# Altium project ArakDisCharger.PrjPcb (part 2 of 2)

## Sheet Arak-AnalogueFrontend.SchDoc
size 431 x 279 mm; Date: Not shown in title block; ApprovedBy: Not shown in title block; CheckedBy: Not shown in title block; Author: Not shown in title block; CompanyName: Not shown in title block; Engineer: Not shown in title block; Organization: Not shown in title block; Address1: Not shown in title block; Address2: Not shown in title block; Address3: Not shown in title block; Address4: Not shown in title block; DocumentNumber: 6; Revision: Use project parameter SCH_Rev; SheetNumber: 6; SheetTotal: 11; PageSetup: Record=PageOptions|CenterHorizontal=True|CenterVertical=True|PrintScale=1.00|XCorrection=1.00|YCorrection=1.00|PrintKind=0|BorderSize=5000000|LeftOffset=0|BottomOffset=0|Orientation=2|PaperLength=1000|PaperWidth=1000|Scale=100|PaperSource=15|PrintQuality=600|MediaType=1|DitherType=10|PaperKind=Letter|PrintScaleMode=1; CurrentTime: Not shown in title block; CurrentDate: Not shown in title block; Time: Not shown in title block; DocumentFullPathAndName: Not shown in title block; DocumentName: Not shown in title block; ModifiedDate: Not shown in title block; ImagePath: Not shown in title block
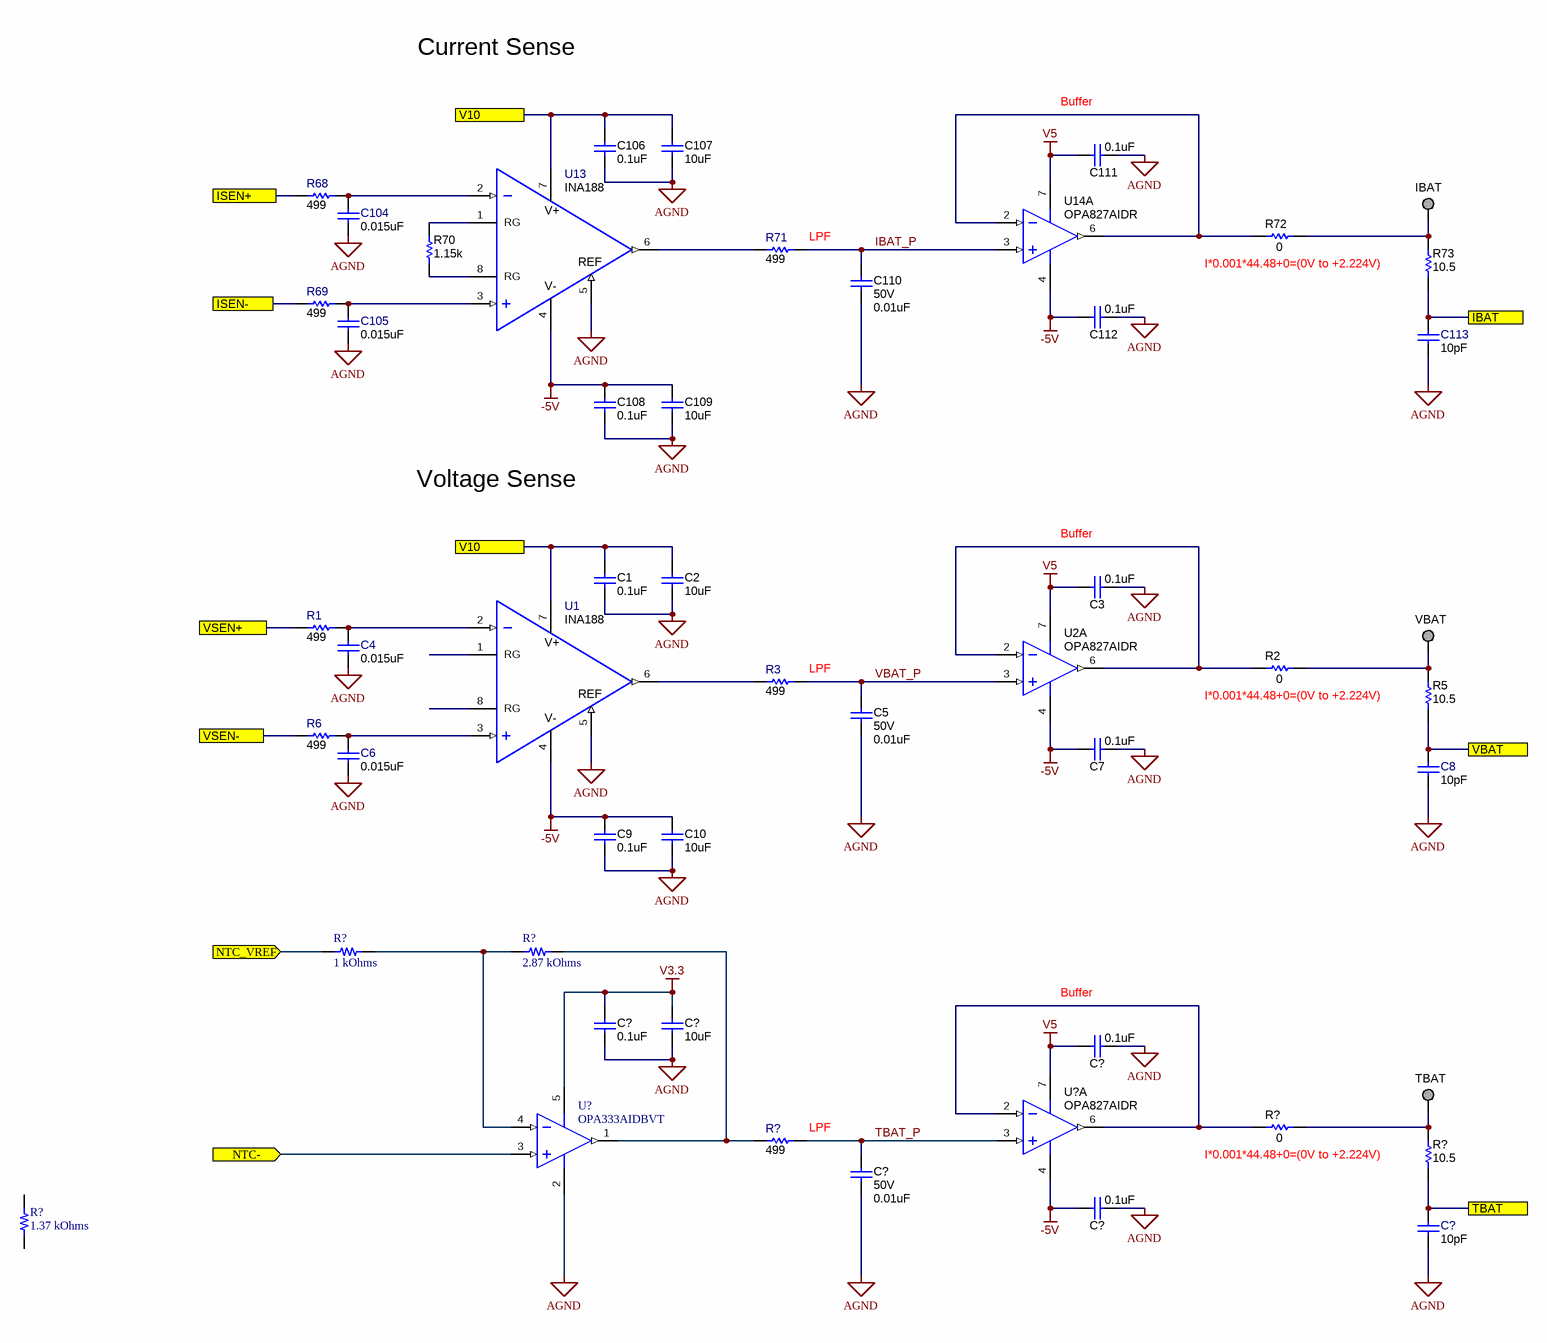
[diagram p1: Arak-AnalogueFrontend.SchDoc]

### Parts
(Parts that share a designator on the sheet are numbered #1, #2 ... from top to bottom, then left to right.)
C1  ValueDisplayed: 0.1uF  [0603]  (hidden comment: Capacitor)
C2  ValueDisplayed: 10uF  [0805_HV]  (hidden comment: Capacitor)
C3  ValueDisplayed: 0.1uF  [0603]  (hidden comment: Capacitor)
C4  ValueDisplayed: 0.015uF  [0603]  (hidden comment: Capacitor)
C5  VDC_V: 50V  ValueDisplayed: 0.01uF  [0603]  (hidden comment: GCM188R71H103KA37D)
C6  ValueDisplayed: 0.015uF  [0603]  (hidden comment: Capacitor)
C7  ValueDisplayed: 0.1uF  [0603]  (hidden comment: Capacitor)
C8  ValueDisplayed: 10pF  [0603]  (hidden comment: Capacitor)
C9  ValueDisplayed: 0.1uF  [0603]  (hidden comment: Capacitor)
C10  ValueDisplayed: 10uF  [0805_HV]  (hidden comment: Capacitor)
C104  ValueDisplayed: 0.015uF  [0603]  (hidden comment: Capacitor)
C105  ValueDisplayed: 0.015uF  [0603]  (hidden comment: Capacitor)
C106  ValueDisplayed: 0.1uF  [0603]  (hidden comment: Capacitor)
C107  ValueDisplayed: 10uF  [0805_HV]  (hidden comment: Capacitor)
C108  ValueDisplayed: 0.1uF  [0603]  (hidden comment: Capacitor)
C109  ValueDisplayed: 10uF  [0805_HV]  (hidden comment: Capacitor)
C110  VDC_V: 50V  ValueDisplayed: 0.01uF  [0603]  (hidden comment: GCM188R71H103KA37D)
C111  ValueDisplayed: 0.1uF  [0603]  (hidden comment: Capacitor)
C112  ValueDisplayed: 0.1uF  [0603]  (hidden comment: Capacitor)
C113  ValueDisplayed: 10pF  [0603]  (hidden comment: Capacitor)
C?#1  ValueDisplayed: 0.1uF  [0603]  (hidden comment: Capacitor)
C?#2  ValueDisplayed: 10uF  [0805_HV]  (hidden comment: Capacitor)
C?#3  ValueDisplayed: 0.1uF  [0603]  (hidden comment: Capacitor)
C?#4  VDC_V: 50V  ValueDisplayed: 0.01uF  [0603]  (hidden comment: GCM188R71H103KA37D)
C?#5  ValueDisplayed: 0.1uF  [0603]  (hidden comment: Capacitor)
C?#6  ValueDisplayed: 10pF  [0603]  (hidden comment: Capacitor)
IBAT  Pogo Pad  [PogoPad]  (value not drawn)  (no BOM)
R1  ValueDisplayed: 499  [0603]  (hidden comment: Resistor)
R2  ValueDisplayed: 0  [0603]  (hidden comment: Resistor)
R3  ValueDisplayed: 499  [0603]  (hidden comment: Resistor)
R5  ValueDisplayed: 10.5  [0603]  (hidden comment: RC0603FR-0710R5L)
R6  ValueDisplayed: 499  [0603]  (hidden comment: Resistor)
R68  ValueDisplayed: 499  [0603]  (hidden comment: Resistor)
R69  ValueDisplayed: 499  [0603]  (hidden comment: Resistor)
R70  1.15k  [0603]
R71  ValueDisplayed: 499  [0603]  (hidden comment: Resistor)
R72  ValueDisplayed: 0  [0603]  (hidden comment: Resistor)
R73  ValueDisplayed: 10.5  [0603]  (hidden comment: RC0603FR-0710R5L)
R?#1  1 kOhms  [RES 0603_1608]
R?#2  2.87 kOhms  [RES 0603_1608]
R?#3  ValueDisplayed: 0  [0603]  (hidden comment: Resistor)
R?#4  ValueDisplayed: 499  [0603]  (hidden comment: Resistor)
R?#5  ValueDisplayed: 10.5  [0603]  (hidden comment: RC0603FR-0710R5L)
R?#6  1.37 kOhms  [RES 0603_1608]
TBAT  Pogo Pad  [PogoPad]  (value not drawn)  (no BOM)
U1  INA188  [D0008A_N]
U2  OPA827AIDR  [D0008A_L]  (part A of 2)
U13  INA188  [D0008A_N]
U14  OPA827AIDR  [D0008A_L]  (part A of 2)
U?#1  OPA827AIDR  [D0008A_L]  (part A of 2)
U?#2  OPA333AIDBVT  [DBV0005A_M]
VBAT  Pogo Pad  [PogoPad]  (value not drawn)  (no BOM)

### Ports
IBAT, ISEN+, ISEN-, NTC- (in), NTC_VREF (in), TBAT, V10, VBAT, VSEN+, VSEN-

### Nets
-5V: C7.1 C9.1 C10.1 C108.1 C109.1 C112.1 C?#5.1 U1.4(V-) U2.4(V-) U13.4(V-) U14.4(V-) U?#1.4(V-)
AGND: C1.2 C2.2 C3.2 C4.2 C5.2 C6.2 C7.2 C8.1 C9.2 C10.2 C104.2 C105.2 C106.2 C107.2 C108.2 C109.2 C110.2 C111.2 C112.2 C113.1 C?#1.2 C?#2.2 C?#3.2 C?#4.2 C?#5.2 C?#6.1 U1.5(REF) U13.5(REF) U?#2.2(V-)
V3.3: C?#1.1 C?#2.1 U?#2.5(V+)
V5: C3.1 C111.1 C?#3.1 U2.7(V+) U14.7(V+) U?#1.7(V+)
IBAT_P: C110.1 R71.1 U14.3(IN+)
TBAT_P: C?#4.1 R?#4.1 U?#1.3(IN+)
VBAT_P: C5.1 R3.1 U2.3(IN+)
NetC1_1: C1.1 C2.1 C106.1 C107.1 U1.7(V+) U13.7(V+) ; port V10
NetC4_1: C4.1 R1.1 U1.2(IN-)
NetC6_1: C6.1 R6.1 U1.3(IN+)
NetC8_2: C8.2 R5.1 ; port VBAT
NetC104_1: C104.1 R68.1 U13.2(IN-)
NetC105_1: C105.1 R69.1 U13.3(IN+)
NetC113_2: C113.2 R73.1 ; port IBAT
NetC?#6_2: C?#6.2 R?#5.1 ; port TBAT
NetIBAT_1: IBAT.1 R72.2 R73.2
NetR1_2: R1.2 ; port VSEN+
NetR2_1: R2.1 U2.2(IN-) U2.6(OUT)
NetR2_2: R2.2 R5.2 VBAT.1
NetR3_2: R3.2 U1.6(OUT)
NetR6_2: R6.2 ; port VSEN-
NetR68_2: R68.2 ; port ISEN+
NetR69_2: R69.2 ; port ISEN-
NetR70_1: R70.1 U13.8(RG)
NetR70_2: R70.2 U13.1(RG)
NetR71_2: R71.2 U13.6(OUT)
NetR72_1: R72.1 U14.2(IN-) U14.6(OUT)
NetR?#1_1: R?#1.1 ; port NTC_VREF
NetR?#1_2: R?#1.2 R?#2.1 U?#2.4(IN-)
NetR?#2_2: R?#2.2 R?#4.2 U?#2.1(OUT)
NetR?#3_1: R?#3.1 U?#1.2(IN-) U?#1.6(OUT)
NetR?#3_2: R?#3.2 R?#5.2 TBAT.1
NetU?#2_3: U?#2.3(IN+) ; port NTC-

Not connected (* = marked no-connect by the designer): R?#6 1 2; U1 1(RG) 8(RG)

### Notes on the sheet
- Current Sense
- (near C111) Buffer
- (near R71) LPF
- (near R72) I*0.001*44.48+0=(0V to +2.224V)
- Voltage Sense
- (near C3) Buffer
- (near R3) LPF
- (near R2) I*0.001*44.48+0=(0V to +2.224V)
- (near C?#3) Buffer
- (near R?#4) LPF
- (near R?#3) I*0.001*44.48+0=(0V to +2.224V)
- Drawn By:
- SVN Rev:
- Number:
- TID #:
- Orderable:
- Rev:
- Sheet Title:
- File:
- Project Title:
- Designed for:
- Assembly Variant:
- Mod. Date:
- Sheet:
- Size:
- of
- B
- http://www.ti.com
- Texas Instruments and/or its licensors do not warrant the accuracy or completeness of this specification or any information contained therein. Texas Instruments and/or its licensors do not warrant that this design will meet the specifications, will be suitable for your application or fit for any particular purpose, or will operate in an implementation. Texas Instruments and/or its licensors do not warrant that the design is production worthy. You should completely validate and test your design implementation to confirm the system functionality for your application.
- Engineer:
- Contact:
- © Texas Instruments

### Library data of the parts
C1 C3 C7 C9 C106 C108 C111 C112 C?#1 C?#3 C?#5 = CMP-0006752-5: CAP, CERM, 0.1 uF, 25 V, +/- 5%, X7R, 0603; PartNumber: 06033C104JAT2A; Manufacturer: AVX; Polarized: N; Value: 0.1uF; U/M: EA; Cap_F: 100nF; ESR_ohm: 0.05; Value1: 0.05 ohm; VDC_V: 25V; TaMin_C: -55°C; TaMax_C: 125°C; AEC Category: Q200; SizeArea_mm2: 1.28; SizeAreaWB_mm2: 4.68; SizeX_mm: 1.6; SizeY_mm: 0.8; SizeZ_mm: 1; CompType: Capacitor; PackageReference: 0603; RoHS: Y; Tolerance_%: 5%; Value2: 25V; MountType: SMT; Technology: Ceramic; TempCo: X7R; Cap_Case: 0603; Published: 2008-06-19; Publisher: Texas Instruments; LatestRevisionDate: 2017-03-09; ComponentLink1Description: Datasheet link; ComponentLink1URL: http://datasheets.avx.com/X7RDielectric.pdf; Supplier 1: Digi-Key; Supplier Part Number 1: 478-3713-1-ND; Supplier 2: Mouser; Supplier Part Number 2: 581-06033C104JAT2A; Supplier 3: Farnell; Supplier Part Number 3: 1740614; AEC Qualified: N; AEC Grade: N/A
C2 C10 C107 C109 C?#2 = CMP-0008315-2: CAP, CERM, 10 uF, 10 V, +/- 10%, X7R, 0805; PartNumber: GRM21BR71A106KE51L; Manufacturer: MuRata; Polarized: N; Value: 10uF; U/M: EA; Cap_F: 10µF; ESR_ohm: 3m; Value1: 0.003 ohm; VDC_V: 10V; TaMin_C: -55°C; TaMax_C: 125°C; Cap_Case: 0805; AEC Category: Q200; SizeArea_mm2: 2.5; SizeAreaWB_mm2: 6.75; SizeX_mm: 2; SizeY_mm: 1.25; SizeZ_mm: 1.45; CompType: Capacitor; PackageReference: 0805; RoHS: Y; Tolerance_%: 10%; Value2: 10V; MountType: SMT; Technology: Ceramic; TempCo: X7R; Published: 2008-06-19; Publisher: Texas Instruments; LatestRevisionDate: 2017-03-09; ComponentLink1Description: Datasheet link; ComponentLink1URL: http://search.murata.co.jp/Ceramy/PnsearchViewAction.do?HnOFG=ON&HnNFG=ON&SEL_CNT=50&sLang=en&sKey=GRM21BR71A106KE51L&x=9&y=9&search=startwith; Supplier 1: Digi-Key; Supplier Part Number 1: 490-3905-1-ND; Supplier 2: Mouser; Supplier Part Number 2: 81-GRM21BR71A106KE51; Supplier 3: Farnell; Supplier Part Number 3: 1828828; AEC Qualified: ?
C4 C6 C104 C105 = CMP-0007383-5: CAP, CERM, 0.015 uF, 16 V, +/- 10%, X7R, 0603; PartNumber: GRM188R71C153KA01D; Manufacturer: MuRata; Polarized: N; U/M: EA; Cap_F: 15nF; Value1: Unknown; VDC_V: 16V; TaMin_C: -55°C; TaMax_C: 125°C; SizeArea_mm2: 1.28; SizeAreaWB_mm2: 4.68; SizeX_mm: 1.6; SizeY_mm: 0.8; SizeZ_mm: 1; AEC Category: Q200; CompType: Capacitor; Value: 0.015uF; PackageReference: 0603; RoHS: Y; Tolerance_%: 10%; Value2: 16V; MountType: SMT; Technology: Ceramic; TempCo: X7R; Cap_Case: 0603; Published: 2008-06-19; Publisher: Texas Instruments; LatestRevisionDate: 2017-03-09; ComponentLink1Description: Datasheet link; ComponentLink1URL: http://search.murata.co.jp/Ceramy/PnsearchViewAction.do?HnOFG=ON&HnNFG=ON&SEL_CNT=50&sLang=en&sKey=GRM188R71C153KA01D&x=9&y=9&search=startwith; Supplier 1: Mouser; Supplier Part Number 1: 81-GRM188R71C153KA; AEC Qualified: ?
C5 C110 C?#4 = CMP-0007143-4: CAP, CERM, 0.01 uF, 50 V, +/- 10%, X7R, AEC-Q200 Grade 1, 0603; Manufacturer: MuRata; TaMin_C: -55°C; Polarized: N; SizeAreaWB_mm2: 4.68; Value1: Unknown; U/M: EA; Value: 0.01uF; TaMax_C: 125°C; SizeZ_mm: 1; SizeX_mm: 1.6; SizeY_mm: 0.8; SizeArea_mm2: 1.28; CompType: Capacitor; AEC Qualified: Y; Cap_F: 10nF; AEC Category: Q200; Supplier Part Number 2: 45Y5166; Publisher: Texas Instruments; Supplier 2: Newark; Supplier Part Number 3: 81-GCM188R71H103KA7D; TempCo: X7R; Supplier 3: Mouser; Published: 2008-06-19; RoHS: Y; MountType: SMT; Supplier 1: Digi-Key; PackageReference: 0603; Tolerance_%: 10%; Cap_Case: 0603; Value2: 50V; LatestRevisionDate: 2017-03-09; PartNumber: GCM188R71H103KA37D; ComponentLink1Description: Datasheet link; AEC Grade: 1; Supplier Part Number 1: 490-4778-1-ND; Technology: Ceramic; ComponentLink1URL: http://psearch.en.murata.com/capacitor/product/GCM188R71H103KA37%23.pdf
C8 C113 C?#6 = CMP-0007170-4: CAP, CERM, 10 pF, 50 V, +/- 5%, C0G/NP0, 0603; PartNumber: GRM1885C1H100JA01D; Manufacturer: MuRata; Polarized: N; Value: 10pF; U/M: EA; Value1: Unknown; VDC_V: 50V; TaMin_C: -55°C; TaMax_C: 125°C; SizeArea_mm2: 1.28; SizeAreaWB_mm2: 4.68; SizeX_mm: 1.6; SizeY_mm: 0.8; SizeZ_mm: 1; AEC Category: Q200; CompType: Capacitor; PackageReference: 0603; RoHS: Y; Cap_F: 10pF; Tolerance_%: 5%; Value2: 50V; MountType: SMT; Technology: Ceramic; TempCo: C0G/NP0; Cap_Case: 0603; Published: 2008-06-19; Publisher: Texas Instruments; LatestRevisionDate: 2017-03-09; ComponentLink1Description: Datasheet link; ComponentLink1URL: http://search.murata.co.jp/Ceramy/PnsearchViewAction.do?HnOFG=ON&HnNFG=ON&SEL_CNT=50&sLang=en&sKey=GRM1885C1H100JA01D&x=9&y=9&search=startwith; Supplier 1: Digi-Key; Supplier Part Number 1: 490-1403-1-ND; Supplier 2: Mouser; Supplier Part Number 2: 81-GRM39C100D50; Supplier 3: Farnell; Supplier Part Number 3: 8819815; AEC Qualified: ?
IBAT TBAT VBAT = PogoPad: Pad for Pogo Pin Connector; SymbolCreator: codlsc; SymbolVersion: 2010-09-27; PackageReference: N/A; CompType: Pogo Pad; Publisher: Texas Instruments; LatestRevisionDate: 2016-12-05; LatestRevisionNote: Added Alternate PartNumber and Alternate Manufacturer parameters to appropriate components.
R1 R3 R6 R68 R69 R71 R?#4 = CMP-0022446-5: RES, 499, 1%, 0.1 W, AEC-Q200 Grade 0, 0603; PartNumber: CRCW0603499RFKEA; Manufacturer: Vishay-Dale; Value: 499; Value_Code: 499R; Power_W: 100mW; Value2: 0.1W; VDC_V: 75V; TempCo: 100 ppm/C; SizeArea_mm2: 1.28; SizeX_mm: 1.6; SizeY_mm: 0.8; SizeZ_mm: 1; EIA_Code: E96; AEC Category: Q200; AEC Qualified: Y; AEC Grade: 0; CompType: Resistor; PackageReference: 0603; RoHS: E; Res_ohm: 499; Tolerance_%: 1%; Value1: 1%; MountType: SMT; Technology: Thick Film; ComponentLink1Description: Datasheet link; ComponentLink1URL: http://www.vishay.com/docs/20035/dcrcwe3.pdf; Supplier 1: Digi-Key; Supplier Part Number 1: 541-499HCT-ND; Supplier 2: Newark; Supplier Part Number 2: 52K8569; Supplier 3: Mouser; Supplier Part Number 3: 71-CRCW0603-499-E3
R2 R72 R?#3 = CMP-0025874-3: RES, 0, 5%, 0.1 W, 0603; PartNumber: ERJ-3GEY0R00V; Manufacturer: Panasonic; Value: 0; Value_Code: 0000; Power_W: 100mW; Value2: 0.1W; VDC_V: 50V; TempCo: 600 ppm/C; EIA_Code: E24; U/M: EA; AEC Category: Q200; SizeArea_mm2: 1.28; SizeX_mm: 1.6; SizeY_mm: 0.8; SizeZ_mm: 1; CompType: Resistor; PackageReference: 0603; RoHS: Y; Res_ohm: 0; Tolerance_%: 5%; Value1: 5%; MountType: SMT; Technology: Thick Film; Published: 2008-06-26; Publisher: Texas Instruments; LatestRevisionDate: 2017-03-09; ComponentLink1Description: Datasheet link; ComponentLink1URL: http://www.panasonic.com/industrial/components/pdf/AOA0000CE1.pdf; Supplier 1: Digi-Key; Supplier Part Number 1: P0.0GCT-ND; Supplier 2: Mouser; Supplier Part Number 2: 667-ERJ-3GEY0R00V; Supplier 3: Farnell; Supplier Part Number 3: 2059527; AEC Qualified: ?
R5 R73 R?#5 = CMP-0022749-2: RES, 10.5, 1%, 0.1 W, 0603; Manufacturer: Yageo America; Power_W: 100mW; TempCo: 200 ppm/C; Value_Code: 10R5; U/M: EA; Value: 10.5; EIA_Code: E96; SizeX_mm: 1.6; SizeY_mm: 0.8; SizeZ_mm: 1; Value2: 0.1W; SizeArea_mm2: 1.28; CompType: Resistor; VDC_V: 150V; AEC Category: Q200; ComponentLink1URL: http://www.yageo.com/pdf/Pu-RC0603_51_PbFree_L_2.pdf; Supplier Part Number 2: 603-RC0603FR-0710R5L; Publisher: Texas Instruments; Supplier 2: Mouser; Supplier Part Number 3: 9238247; Supplier 3: Farnell; Published: 2008-06-26; RoHS: Y; Value1: 1%; MountType: SMT; Supplier 1: Digi-Key; PackageReference: 0603; Tolerance_%: 1%; Res_ohm: 10.5; LatestRevisionDate: 2017-03-09; PartNumber: RC0603FR-0710R5L; AEC Qualified: ?; ComponentLink1Description: Datasheet link; Supplier Part Number 1: 311-10.5HRCT-ND; Technology: Thick Film
R70 = CMP-0023872-3: RES, 1.15 k, 0.1%, 0.1 W, 0603; Manufacturer: Yageo America; PartNumber: RT0603BRD071K15L; Power_W: 100mW; TempCo: 25 ppm/C; Value_Code: 1k15; U/M: EA; EIA_Code: E192; SizeX_mm: 1.6; SizeY_mm: 0.8; SizeZ_mm: 1; SizeArea_mm2: 1.28; CompType: Resistor; Value2: 0.1W; VDC_V: 75V; AEC Category: Q200; Publisher: Texas Instruments; Published: 2008-06-26; RoHS: Y; Value1: 0.1%; MountType: SMT; Value: 1.15k; PackageReference: 0603; Tolerance_%: 0.1%; Res_ohm: 1.15k; LatestRevisionDate: 2017-03-09; AEC Qualified: ?; ComponentLink1Description: Datasheet link; Technology: Thin Film; ValueDisplayed: 1.15k; ComponentLink1URL: http://www.yageo.com/pdf/PYu-RT_1-to-0.05_RoHS_L_3.pdf
R?#1 = TNPW06031K00BYEN: RES 1K OHM 0.1% 1/8W 0603; Manufacturer: Vishay Dale; Power (Watts): 0.125W, 1/8W; Temperature Coefficient: ±10ppm/°C; Part Number: TNPW06031K00BYEN; Value: 1 kOhms; ComponentLink1Description: Datasheet; ComponentLink1URL: http://www.vishay.com/docs/28758/tnpw_e3.pdf; ComponentLink2Description: DigiKey Link; ComponentLink2URL: http://digikey.com/product-detail/en/vishay-dale/TNPW06031K00BYEN/541-4408-1-ND/8629044; Composition: Thin Film; Device Package: 0603 (1608 Metric); Features: Anti-Sulfur, Automotive AEC-Q200, Moisture Resistant; Height - Seated (Max): 0.022" (0.55mm); LastUpdated: 21/01/2020 12:18:21 AM; Lifecycle Status: Active; Minimum Order: 1; Number of Terminations: 2; Operating Temperature: -55°C ~ 155°C; Package / Case: 0603 (1608 Metric); Packaging: TapeAndReel; PartId: 21027; Part Status: Active; Price: 0.27; Ratings: AEC-Q200; Resistance: 1 kOhms; Series: TNPW e3; Size / Dimension: 0.061" L x 0.033" W (1.55mm x 0.85mm); Supplier 1: DigiKey; Supplier Part Number 1: 541-4408-1-ND; Supplier Device Package: 0603; Tolerance: ±0.1%
R?#2 = TNPW06032K87BEEA: RES 2.87K OHM 0.1% 1/8W 0603; Manufacturer: Vishay Dale; Power (Watts): 0.125W, 1/8W; Temperature Coefficient: ±25ppm/°C; Part Number: TNPW06032K87BEEA; Value: 2.87 kOhms; ComponentLink1Description: Datasheet; ComponentLink1URL: http://www.vishay.com/docs/28758/tnpw_e3.pdf; ComponentLink2Description: DigiKey Link; ComponentLink2URL: http://digikey.com/product-detail/en/vishay-dale/TNPW06032K87BEEA/541-3180-1-ND/6532822; Composition: Thin Film; Device Package: 0603 (1608 Metric); Features: Anti-Sulfur, Automotive AEC-Q200, Moisture Resistant; Height - Seated (Max): 0.022" (0.55mm); LastUpdated: 21/01/2020 12:17:06 AM; Lifecycle Status: Active; Minimum Order: 1; Number of Terminations: 2; Operating Temperature: -55°C ~ 155°C; Package / Case: 0603 (1608 Metric); Packaging: TapeAndReel; PartId: 23190; Part Status: Active; Price: 0.11; Ratings: AEC-Q200; Resistance: 2.87 kOhms; Series: TNPW e3; Size / Dimension: 0.063" L x 0.033" W (1.60mm x 0.85mm); Supplier 1: DigiKey; Supplier Part Number 1: 541-3180-1-ND; Supplier Device Package: 0603; Tolerance: ±0.1%
R?#6 = TNPW06031K37BEEA: RES 1.37K OHM 0.1% 1/8W 0603; Manufacturer: Vishay Dale; Power (Watts): 0.125W, 1/8W; Temperature Coefficient: ±25ppm/°C; Part Number: TNPW06031K37BEEA; Value: 1.37 kOhms; ComponentLink1Description: Datasheet; ComponentLink1URL: http://www.vishay.com/docs/28758/tnpw_e3.pdf; ComponentLink2Description: DigiKey Link; ComponentLink2URL: http://digikey.com/product-detail/en/vishay-dale/TNPW06031K37BEEA/541-3048-1-ND/6073691; Composition: Thin Film; Device Package: 0603 (1608 Metric); Features: Anti-Sulfur, Automotive AEC-Q200, Moisture Resistant; Height - Seated (Max): 0.022" (0.55mm); LastUpdated: 21/01/2020 12:14:57 AM; Lifecycle Status: Active; Minimum Order: 1; Number of Terminations: 2; Operating Temperature: -55°C ~ 155°C; Package / Case: 0603 (1608 Metric); Packaging: TapeAndReel; PartId: 25753; Part Status: Active; Price: 0.11; Ratings: AEC-Q200; Resistance: 1.37 kOhms; Series: TNPW e3; Size / Dimension: 0.063" L x 0.033" W (1.60mm x 0.85mm); Supplier 1: DigiKey; Supplier Part Number 1: 541-3048-1-ND; Supplier Device Package: 0603; Tolerance: ±0.1%
U1 U13 = CMP-0075744-1: 36-V, Zero-Drift, Rail-to-Rail-Out Instrumentation Amplifier, D0008A (SOIC-8); PartNumber: INA188IDR; Alternate PartNumber: INA188ID; Manufacturer: Texas Instruments; SizeArea_mm2: 30.38; SizeAreaWB_mm2: 56.58; SizeX_mm: 4.9; SizeY_mm: 6.2; SizeZ_mm: 1.75; CompType: IC; U/M: EA; PackageReference: D0008A; PackageDescription: SOIC-8; MountType: SMT; ComponentLink1Description: Datasheet Link; ComponentLink1URL: http://www.ti.com/lit/ds/symlink/ina188.pdf; RoHS: Y; Publisher: Texas Instruments; LatestRevisionDate: 2017-06-09; Alternate Manufacturer: Texas Instruments
U2 U14 U?#1 = CMP-0041267-2: Low-Noise, High-Precision, JFET-Input Operational Amplifier, 8 to 36 V, -40 to 125 degC, 8-pin SOIC (D8), Green (RoHS & no Sb/Br); Manufacturer: Texas Instruments; Vmax(V): 36; GBW(Typ)(MHz): 22; Vmin(V): 8; Iq per channel(Max)(mA): 5.2; SubFamily: Audio Operational Amplifier; Number of Channels: 1; Vn at Flatband(Typ)(nV/rtHz): 4; ComponentLink1URL: http://www.ti.com/; Code_JEDEC: MS-012; PackageDescription: 8-Pin Plastic Small Outline, Body 4.9 x 3.9 mm, Pitch 1.27 mm; ComponentLink2URL: http://www.ti.com/general/docs/lit/getliterature.tsp?genericPartNumber=OPA827&fileType=pdf; ComponentLink3Description: Package Specification; Eco-Plan: Green (RoHS & no Sb/Br); ComponentLink2Description: Datasheet; ComponentLink3URL: http://www.ti.com/litv/pdf/msoi002j; PackageReference: D0008A; DatasheetVersion: SBOS376H; PartNumber: OPA827AIDR; PackageVersion: 4040047-3/M, 06/2011; Mounting Technology: Surface Mount; ComponentLink1Description: Manufacturer URL
U?#2 = CMP-0272-00841-3: 17 uA, MicroPower, Precision, Zero Drift CMOS Operational Amplifier, 1.8 to 5.5 V, -40 to 125 degC, 5-pin SOT23 (DBV5), Green (RoHS & no Sb/Br); Manufacturer: Texas Instruments; Vio (25C)(Max)(mV): 0.01; Sub Family: Low Offset Voltage Amplifier (<=500uV), Low Power Amp (<=500uA), Low Supply Voltage Amplifier (<=2.7V), Precision Amplifier, Zero Drift Precision Amplifier; Iq per channel(Max)(mA): 0.025; CMRR(Min)(dB): 106; Total Supply Voltage(Max)(+5V is 5, +/-5V is 10): 5.5; Number of Channels: 1; Total Supply Voltage(Min)(+5V is 5, +/-5V is 10): 1.8; Slew Rate(Typ)(V/us): 0.16; IIB(Max)(pA): 200; Offset Drift(Typ)(uV/C): 0.02; PackageDescription: 5-Pin Plastic Small Outline, Body 1.6 x 2.9 mm, Pitch 0.95 mm; DatasheetVersion: SBOS351C; ComponentLink1Description: Manufacturer URL; ComponentLink1URL: http://www.ti.com/; ComponentLink3URL: http://www.ti.com/litv/pdf/mpds018i; Code_JEDEC: MO-178; ComponentLink3Description: Package Specification; PackageVersion: 4073253-4/K, 03/2006; PackageReference: DBV0005A; ComponentLink2URL: http://www.ti.com/general/docs/lit/getliterature.tsp?genericPartNumber=OPA333&fileType=pdf; ComponentLink2Description: Datasheet; PartNumber: OPA333AIDBVT; Eco-Plan: Green (RoHS & no Sb/Br); Mounting Technology: Surface Mount

## Sheet Arak-DAC.SchDoc
size 431 x 279 mm; Date: Not shown in title block; ApprovedBy: Not shown in title block; CheckedBy: Not shown in title block; Author: Not shown in title block; CompanyName: Not shown in title block; Engineer: Not shown in title block; Organization: Not shown in title block; Address1: Not shown in title block; Address2: Not shown in title block; Address3: Not shown in title block; Address4: Not shown in title block; DocumentNumber: 8; Revision: Use project parameter SCH_Rev; SheetNumber: 8; SheetTotal: 11; PageSetup: Record=PageOptions|CenterHorizontal=True|CenterVertical=True|PrintScale=1.00|XCorrection=1.00|YCorrection=1.00|PrintKind=0|BorderSize=5000000|LeftOffset=0|BottomOffset=0|Orientation=2|PaperLength=1000|PaperWidth=1000|Scale=100|PaperSource=15|PrintQuality=600|MediaType=1|DitherType=10|PaperKind=Letter|PrintScaleMode=1; CurrentTime: Not shown in title block; CurrentDate: Not shown in title block; Time: Not shown in title block; DocumentFullPathAndName: Not shown in title block; DocumentName: Not shown in title block; ModifiedDate: Not shown in title block; ImagePath: Not shown in title block
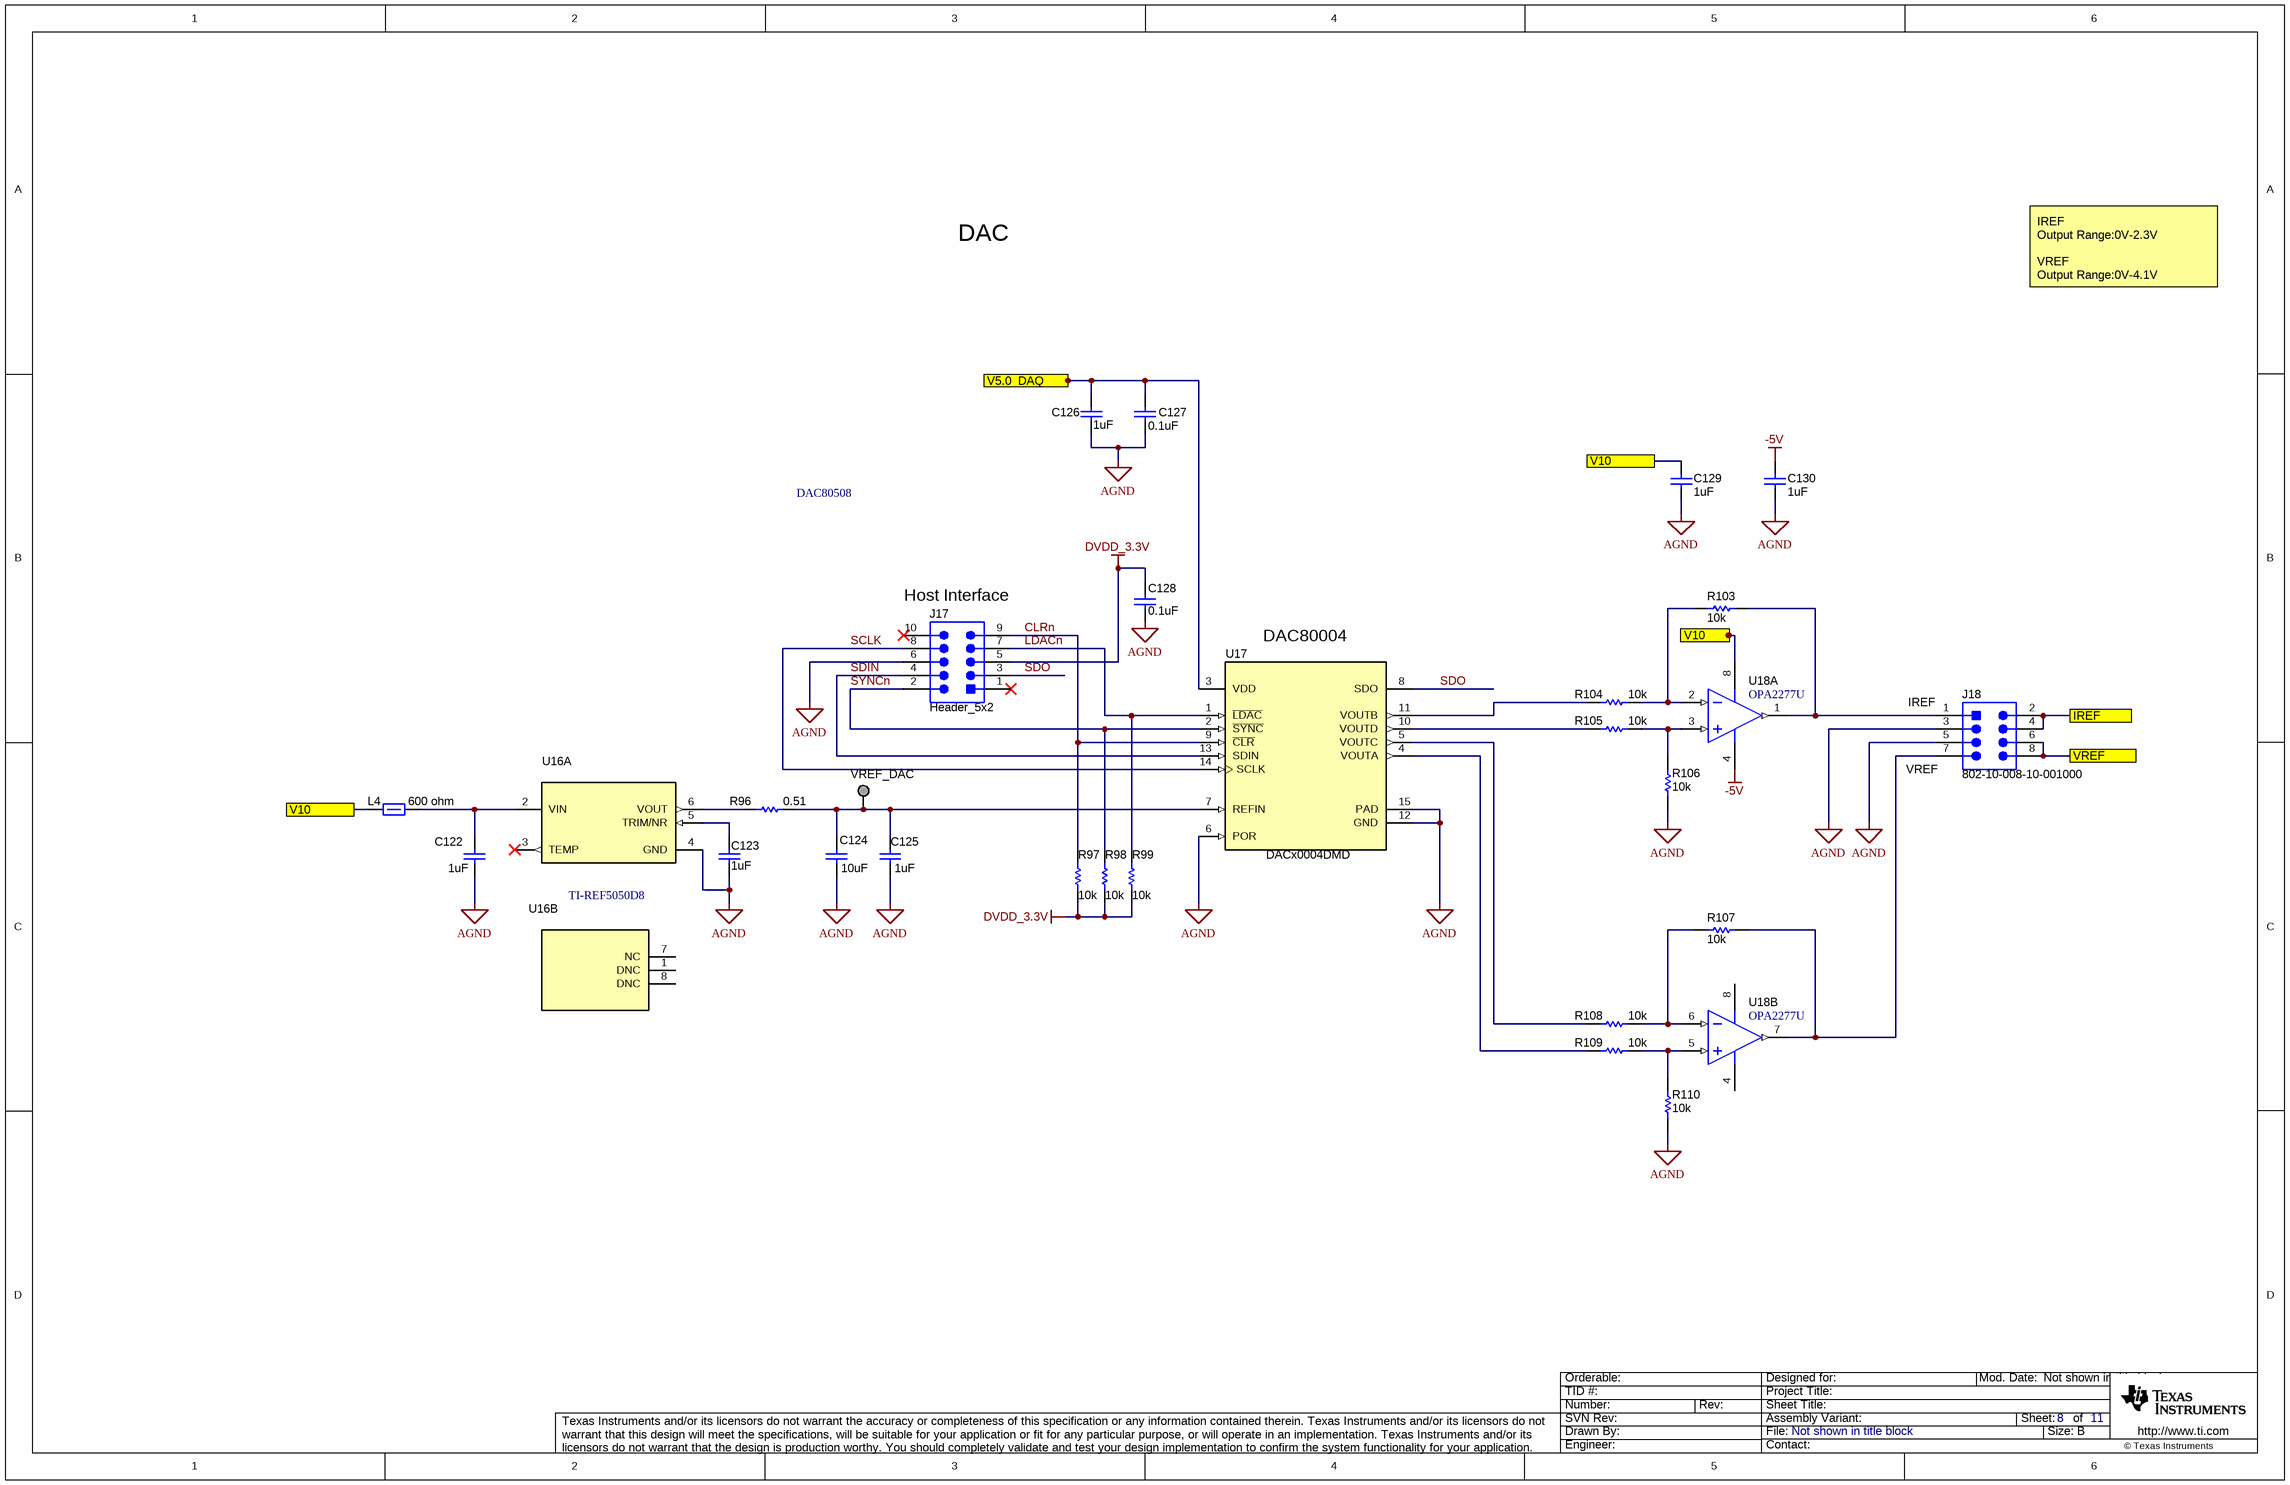
[diagram p2: Arak-DAC.SchDoc]

### Parts
C122  ValueDisplayed: 1uF  [1206]  (hidden comment: Capacitor)
C123  ValueDisplayed: 1uF  [1206]  (hidden comment: Capacitor)
C124  ValueDisplayed: 10uF  [0805_HV]  (hidden comment: Capacitor)
C125  ValueDisplayed: 1uF  [1206]  (hidden comment: Capacitor)
C126  ValueDisplayed: 1uF  [1206]  (hidden comment: Capacitor)
C127  ValueDisplayed: 0.1uF  [0603]  (hidden comment: Capacitor)
C128  ValueDisplayed: 0.1uF  [0603]  (hidden comment: Capacitor)
C129  ValueDisplayed: 1uF  [0603]  (hidden comment: Capacitor)
C130  ValueDisplayed: 1uF  [0603]  (hidden comment: Capacitor)
J17  Header_5x2  [Assman_AWHW-10G-0x02-T]
J18  802-10-008-10-001000  [Mill-Max_802-10-008-10-001000]
L4  value 600 ohm  [0603]  (hidden comment: Ferrite_Bead)
R96  ValueDisplayed: 0.51  [0603]  (hidden comment: Resistor)
R97  ValueDisplayed: 10k  [0603]  (hidden comment: Resistor)
R98  ValueDisplayed: 10k  [0603]  (hidden comment: Resistor)
R99  ValueDisplayed: 10k  [0603]  (hidden comment: Resistor)
R103  ValueDisplayed: 10k  [0603]  (hidden comment: Resistor)
R104  ValueDisplayed: 10k  [0603]  (hidden comment: Resistor)
R105  ValueDisplayed: 10k  [0603]  (hidden comment: Resistor)
R106  ValueDisplayed: 10k  [0603]  (hidden comment: Resistor)
R107  ValueDisplayed: 10k  [0603]  (hidden comment: Resistor)
R108  ValueDisplayed: 10k  [0603]  (hidden comment: Resistor)
R109  ValueDisplayed: 10k  [0603]  (hidden comment: Resistor)
R110  ValueDisplayed: 10k  [0603]  (hidden comment: Resistor)
U16  TI-REF5050D8  [D0008A_N]  (parts A,B of 2)
U17  DACx0004DMD  [DMD0014A]
U18  OPA2277U  [D0008A_N]  (parts A,B of 2)
VREF_DAC  Pogo Pad  [PogoPad]  (value not drawn)  (no BOM)

### Ports
IREF, V5.0_DAQ, V10, VREF

### Nets
-5V: C130.1 U18.4(V-)
AGND: C122.2 C123.2 C124.2 C125.2 C126.2 C127.2 C128.2 C129.2 C130.2 J17.6 J18.3 J18.5 R106.1 R110.1 U16.4(GND) U17.6(POR) U17.12(GND) U17.15(PAD)
AVDD: C126.1 C127.1 U17.3(VDD) ; port V5.0_DAQ
DVDD_3.3V: C128.1 J17.5 R97.1 R98.1 R99.1
CLRn: J17.9 R97.2 U17.9(~{CLR})
LDACn: J17.7 R99.2 U17.1(~{LDAC})
SCLK: J17.8 U17.14(SCLK)
SDIN: J17.4 U17.13(SDIN)
SDO: J17.3 U17.8(SDO)
SYNCn: J17.2 R98.2 U17.2(~{SYNC})
NetC1_1: C129.1 L4.1 U18.8(V+) ; port V10
NetC122_1: C122.1 L4.2 U16.2(VIN)
NetC123_1: C123.1 U16.5(TRIM/NR)
NetC124_1: C124.1 C125.1 R96.2 U17.7(REFIN) VREF_DAC.1
NetJ18_1: J18.1 R103.1 U18.1(OUT_A)
NetJ18_2: J18.2 J18.4 ; port IREF
NetJ18_6: J18.6 J18.8 ; port VREF
NetJ18_7: J18.7 R107.1 U18.7(OUT_B)
NetR96_1: R96.1 U16.6(VOUT)
NetR103_2: R103.2 R104.1 U18.2(IN_A-)
NetR104_2: R104.2 U17.11(VOUTB)
NetR105_1: R105.1 R106.2 U18.3(IN_A+)
NetR105_2: R105.2 U17.10(VOUTD)
NetR107_2: R107.2 R108.1 U18.6(IN_B-)
NetR108_2: R108.2 U17.5(VOUTC)
NetR109_1: R109.1 R110.2 U18.5(IN_B+)
NetR109_2: R109.2 U17.4(VOUTA)

Not connected (* = marked no-connect by the designer): J17 1* 10*; U16 1(DNC) 3(TEMP)* 7(NC) 8(DNC)

### Notes on the sheet
- DAC
- IREF
  Output Range:0V-2.3V
  VREF
  Output Range:0V-4.1V
- DAC80508
- (near J17) Host Interface
- (near U17) DAC80004
- (near J18) IREF
- (near J18) VREF
- Drawn By:
- SVN Rev:
- Number:
- TID #:
- Orderable:
- Rev:
- Sheet Title:
- File:
- Project Title:
- Designed for:
- Assembly Variant:
- Mod. Date:
- Sheet:
- Size:
- of
- B
- http://www.ti.com
- Texas Instruments and/or its licensors do not warrant the accuracy or completeness of this specification or any information contained therein. Texas Instruments and/or its licensors do not warrant that this design will meet the specifications, will be suitable for your application or fit for any particular purpose, or will operate in an implementation. Texas Instruments and/or its licensors do not warrant that the design is production worthy. You should completely validate and test your design implementation to confirm the system functionality for your application.
- Engineer:
- Contact:
- © Texas Instruments

### Library data of the parts
C122 C123 C125 C126 = CMP-0008509-2: CAP, CERM, 1 uF, 25 V, +/- 10%, X7R, 1206; PartNumber: 12063C105KAT2A; Manufacturer: AVX; Polarized: N; Value: 1uF; U/M: EA; Cap_F: 1µF; ESR_ohm: 0.013; Value1: 0.013 ohm; VDC_V: 25V; TaMin_C: -55°C; TaMax_C: 125°C; SizeArea_mm2: 5.12; SizeAreaWB_mm2: 10.92; SizeX_mm: 3.2; SizeY_mm: 1.6; SizeZ_mm: 1.35; AEC Category: Q200; CompType: Capacitor; PackageReference: 1206; RoHS: Y; Tolerance_%: 10%; Value2: 25V; MountType: SMT; Technology: Ceramic; TempCo: X7R; Cap_Case: 1206; Published: 2008-06-19; Publisher: Texas Instruments; LatestRevisionDate: 2017-03-09; ComponentLink1Description: Datasheet link; ComponentLink1URL: http://datasheets.avx.com/X7RDielectric.pdf; Supplier 1: Digi-Key; Supplier Part Number 1: 478-1567-1-ND; Supplier 2: Newark; Supplier Part Number 2: 96K4787; Supplier 3: Mouser; Supplier Part Number 3: 581-12063C105K; AEC Qualified: N; AEC Grade: N/A
C124 = CMP-0008273-1: CAP, CERM, 10 uF, 35 V, +/- 10%, X6S, 0805; PartNumber: GRM21BC8YA106KE11L; Manufacturer: MuRata; Polarized: N; Value: 10uF; U/M: EA; Cap_F: 10µF; Value1: Unknown; VDC_V: 35V; TaMin_C: -55°C; TaMax_C: 105°C; Cap_Case: 0805; SizeArea_mm2: 2.5; SizeAreaWB_mm2: 6.75; SizeX_mm: 2; SizeY_mm: 1.25; SizeZ_mm: 1.45; AEC Category: Q200; CompType: Capacitor; PackageReference: 0805; RoHS: Y; Tolerance_%: 10%; Value2: 35V; MountType: SMT; Technology: Ceramic; TempCo: X6S; Published: 2008-06-19; Publisher: Texas Instruments; LatestRevisionDate: 2017-03-09; ComponentLink1Description: Datasheet link; ComponentLink1URL: http://search.murata.co.jp/Ceramy/image/img/A01X/G101/ENG/GRM21BC8YA106KE11-01.pdf; Supplier 1: Digi-Key; Supplier Part Number 1: 490-10504-1-ND; Supplier 2: Newark; Supplier Part Number 2: 96Y9269; Supplier 3: Mouser; Supplier Part Number 3: 81-GRM21BC8YA106KE1L; AEC Qualified: N; AEC Grade: N/A
C127 C128 = CMP-0006857-4: CAP, CERM, 0.1 uF, 16 V, +/- 5%, X7R, 0603; PartNumber: C0603C104J4RACTU; Manufacturer: Kemet; Polarized: N; Value: 0.1uF; U/M: EA; Cap_F: 100nF; Value1: Unknown; VDC_V: 16V; TaMin_C: -55°C; TaMax_C: 125°C; SizeArea_mm2: 1.28; SizeAreaWB_mm2: 4.68; SizeX_mm: 1.6; SizeY_mm: 0.8; SizeZ_mm: 1; AEC Category: Q200; CompType: Capacitor; PackageReference: 0603; RoHS: Y; Tolerance_%: 5%; Value2: 16V; MountType: SMT; Technology: Ceramic; TempCo: X7R; Cap_Case: 0603; Published: 2008-06-19; Publisher: Texas Instruments; LatestRevisionDate: 2017-03-09; ComponentLink1Description: Datasheet link; ComponentLink1URL: http://www.kemet.com/kemet/web/homepage/kechome.nsf/vapubfiles/F3102_Y5V.pdf/$file/F3102_Y5V.pdf; Supplier 1: Digi-Key; Supplier Part Number 1: 399-1097-1-ND; Supplier 2: Mouser; Supplier Part Number 2: 80-C0603C104J4R; Supplier 3: Farnell; Supplier Part Number 3: 1650834; AEC Qualified: ?
C129 C130 = CMP-0007067-4: CAP, CERM, 1 uF, 35 V, +/- 10%, X7R, AEC-Q200 Grade 1, 0603; PartNumber: CGA3E1X7R1V105K080AC; Manufacturer: TDK; Polarized: N; Value: 1uF; U/M: EA; Cap_F: 1µF; ESR_ohm: 5.522m; Value1: 0.005522 ohm; VDC_V: 35V; IRMS_A: 2.21617A; TaMin_C: -55°C; TaMax_C: 125°C; SizeArea_mm2: 1.28; SizeAreaWB_mm2: 4.68; SizeX_mm: 1.6; SizeY_mm: 0.8; SizeZ_mm: 1; AEC Category: Q200; AEC Qualified: Y; CompType: Capacitor; PackageReference: 0603; RoHS: Y; Tolerance_%: 10%; Value2: 35V; MountType: SMT; Technology: Ceramic; TempCo: X7R; Cap_Case: 0603; Published: 2008-06-19; Publisher: Texas Instruments; LatestRevisionDate: 2017-03-09; ComponentLink1Description: Datasheet link; ComponentLink1URL: https://product.tdk.com/en/search/capacitor/ceramic/mlcc/info?part_no=CGA3E1X7R1V105K080AC; Supplier 1: Digi-Key; Supplier Part Number 1: 445-174215-1-ND; Supplier 2: Mouser; Supplier Part Number 2: 810-CGA3E1X7R1V105K080AC; AEC Grade: 1
J17 = CMP-0075161-1: Header(Shrouded), 2.54mm, 5x2, Gold, TH; PartNumber: AWHW-10G-0202-T; Manufacturer: Assman WSW; Pitch_mm: 2.54; Gender: Male; Shrouded: Y; Row_Count: 2; CNHeader: False; Green_Lifecycle: Active; Green_REACh: Passed; PackageReference: Header, 2.54mm, 5x2, TH; CompType: Header; RoHS: Y; MountType: TH; ComponentLink1Description: Datasheet URL; ComponentLink1URL: http://www.assmann.us/specs/AWHW-xxG-0x02-T.pdf; Orientation: Vertical; PinCount: 10; RowSpacing_mm: 2.54; ContactFinish: Gold; Color: Gray; Publisher: Texas Instruments; LatestRevisionDate: 2017-07-12; Supplier 1: Digi-Key; Supplier Part Number 1: AWHW-10G-0202-T-ND; CT: False; Green_EU RoHS-2: Incomplete; Green_EU RoHS: Passed
J18 = CMP-0055096-1: Header, 2.54 mm, 4x2, Gold, TH; Manufacturer: Mill-Max; CNHeader: TRUE; Shrouded: N; Gender: Male; Row_Count: 2; RowSpacing_mm: 2.54; CT: FALSE; ComponentLink1URL: https://www.mill-max.com/assets/pdfs/metric/055M.PDF; ClassName: Header; Publisher: Texas Instruments; Color: Black; RoHS: Y; MountType: TH; Supplier 1: Digi-Key; PackageReference: Header, 2.54 mm, 4x2, TH; PinCount: 8; CompType: Header; LatestRevisionDate: 26/05/2017; PartNumber: 802-10-008-10-001000; Orientation: Vertical; ComponentLink1Description: Datasheet URL; Supplier Part Number 1: ED1309-08-ND; Pitch_mm: 2.54; ContactFinish: Gold
L4 = CMP-0003197-2: Ferrite Bead, 600 ohm @ 100 MHz, 1 A, 0603; PartNumber: 742792651; Manufacturer: Wurth Elektronik; Imax_A: 1A; DCR_ohm: 2d; Value1: 0.2 ohm; ZTyp@100MHz_Ohm: 600; Ztyp@1GHz_Ohm: 257.548; SizeArea_mm2: 1.28; SizeAreaWB_mm2: 4.68; SizeX_mm: 1.6; SizeY_mm: 0.8; SizeZ_mm: 1; CompType: Ferrite Bead; Value2: 1A; MountType: SMT; PackageReference: 0603; Published: 2014-04-30; Publisher: Texas Instruments; LatestRevisionDate: 2017-03-09; ComponentLink1Description: Datasheet link; ComponentLink1URL: http://katalog.we-online.de/pbs/datasheet/742792651.pdf; RoHS: Y; Supplier 1: Digi-Key; Supplier Part Number 1: 732-1593-1-ND; Supplier 2: Newark; Supplier Part Number 2: 08P2439; Supplier 3: Mouser; Supplier Part Number 3: 710-742792651; ValueDisplayed: 600 ohm
R96 = CMP-0022717-2: RES, 0.51, 1%, 0.1 W, AEC-Q200 Grade 1, 0603; PartNumber: ERJ-3RQFR51V; Manufacturer: Panasonic; Value: 0.51; Res_ohm: 5.1d; Value_Code: R510; Power_W: 100mW; Value2: 0.1W; TempCo: 300 ppm/C; SizeArea_mm2: 1.28; SizeX_mm: 1.6; SizeY_mm: 0.8; SizeZ_mm: 1; EIA_Code: E96; U/M: EA; AEC Category: Q200; AEC Qualified: Y; CompType: Resistor; PackageReference: 0603; RoHS: Y; Tolerance_%: 1%; Value1: 1%; MountType: SMT; Technology: Thick Film; Published: 2008-06-26; Publisher: Texas Instruments; LatestRevisionDate: 2017-03-09; ComponentLink1Description: Datasheet link; ComponentLink1URL: http://industrial.panasonic.com/www-data/pdf/AOA0000/AOA0000CE3.pdf; Supplier 1: Digi-Key; Supplier Part Number 1: P.51AJCT-ND; Supplier 2: Newark; Supplier Part Number 2: 51W9702; Supplier 3: Mouser; Supplier Part Number 3: 667-ERJ-3RQFR51V; AEC Grade: 1
R97-R99 R103-R110 = CMP-0025701-4: RES, 10 k, 5%, 0.1 W, AEC-Q200 Grade 0, 0603; PartNumber: CRCW060310K0JNEA; Manufacturer: Vishay-Dale; Value: 10k; Value_Code: 10k0; Power_W: 100mW; Value2: 0.1W; VDC_V: 75V; TempCo: 200 ppm/C; SizeArea_mm2: 1.28; SizeX_mm: 1.6; SizeY_mm: 0.8; SizeZ_mm: 1; EIA_Code: E24; AEC Category: Q200; AEC Qualified: Y; AEC Grade: 0; CompType: Resistor; PackageReference: 0603; RoHS: E; Res_ohm: 10k; Tolerance_%: 5%; Value1: 5%; MountType: SMT; Technology: Thick Film; ComponentLink1Description: Datasheet link; ComponentLink1URL: http://www.vishay.com/docs/20035/dcrcwe3.pdf; Supplier 1: Digi-Key; Supplier Part Number 1: 541-10KGCT-ND; Supplier 2: Newark; Supplier Part Number 2: 52K8066; Supplier 3: Mouser; Supplier Part Number 3: 71-CRCW0603J-10K-E3
U16 = CMP-0032617-1: Low Noise, Very Low Drift, Precision Voltage Reference, -40 to 125 degC, 8-pin SOIC (D), Green (RoHS & no Sb/Br); PartNumber: REF5050AID; Manufacturer: Texas Instruments; Initial Accuracy @ 25/deg C(%): 0.05; Iout/Iz(Max)(mA): 10; Iq(Max)(uA): 1000; Rating: Catalog; SubFamily: Series Voltage Reference; Temp Coeff(Max)(ppm/ degree C): 3; VI(Max)(V): 18; VI(Min)(V): 5.2; VO(V): 5; PackageReference: D0008A; PackageDescription: 8-Pin Plastic Small Outline, Body 4.9 x 3.9 mm, Pitch 1.27 mm; ComponentLink1Description: Manufacturer URL; ComponentLink1URL: http://www.ti.com/; Code_JEDEC: MS-012; ComponentLink2Description: Datasheet; ComponentLink2URL: http://www.ti.com/general/docs/lit/getliterature.tsp?genericPartNumber=REF5050&fileType=pdf; ComponentLink3Description: Package Specification; ComponentLink3URL: http://www.ti.com/litv/pdf/msoi002j; DatasheetVersion: SBOS410E; Eco-Plan: Green (RoHS & no Sb/Br); Mounting Technology: Surface Mount; PackageVersion: 4040047-3/M
U17 = CMP-0013342-2: QUAD 16-BIT, 1LSB INL, BUFFERED, VOLTAGE-OUTPUT DIGITAL-to-ANALOG CONVERTERS, DMD0014A (VSON-14); PartNumber: DAC80004IDMD; Manufacturer: Texas Instruments; SizeArea_mm2: 12; SizeAreaWB_mm2: 20; SizeX_mm: 3; SizeY_mm: 4; SizeZ_mm: 1; CompType: IC; U/M: EA; PackageReference: DMD0014A; PackageDescription: VSON-14; MountType: SMT; ComponentLink1Description: Datasheet Link; ComponentLink1URL: https://sps06.itg.ti.com/sites/KMS/crossdivteams/altium/docs/ComponentDatasheets/DAC80004.pdf; Publisher: Texas Instruments; LatestRevisionDate: 2017-03-09; Alternate Manufacturer: Texas Instruments
U18 = CMP-0040655-1: High Precision Operational Amplifier, 4 to 36 V, -40 to 85 degC, 8-pin SOIC (D8), Green (RoHS & no Sb/Br); Manufacturer: Texas Instruments; CMRR(Min)(dB): 130; GBW(Typ)(MHz): 1; IIB(Max)(pA): 1000; Iq per channel(Max)(mA): 0.825; Number of Channels: 2; Offset Drift(Typ)(uV/C): 0.1; Packing: TUBE; Rating: Catalog; Slew Rate(Typ)(V/us): 0.8; Sub Family: High Supply Voltage Amplifier (>=30V), Low Noise Amp (<=10nV/rtHz), Low Offset Voltage Amplifier (<=500uV), Precision Amplifier; Total Supply Voltage(Max)(+5V is 5, +/-5V is 10): 36; Total Supply Voltage(Min)(+5V is 5, +/-5V is 10): 4; Vio (25C)(Max)(mV): 0.025; DatasheetVersion: SBOS079A; PackageVersion: 4040047-3/M, 06/2011; PackageReference: D0008A; PackageDescription: 8-Pin Plastic Small Outline, Body 4.9 x 3.9 mm, Pitch 1.27 mm; Eco-Plan: Green (RoHS & no Sb/Br); Code_JEDEC: MS-012; PartNumber: OPA2277U; ComponentLink1Description: Manufacturer URL; ComponentLink1URL: http://www.ti.com/; ComponentLink2Description: Datasheet; ComponentLink2URL: http://www.ti.com/lit/ds/symlink/opa2277.pdf; ComponentLink3Description: Package Specification; ComponentLink3URL: http://www.ti.com/litv/pdf/msoi002j; Mounting Technology: Surface Mount
VREF_DAC = PogoPad: as IBAT on sheet Arak-AnalogueFrontend; SymbolVersion: 2010-09-27; PackageReference: N/A; CompType: Pogo Pad; Publisher: Texas Instruments; LatestRevisionDate: 2016-12-05; LatestRevisionNote: Added Alternate PartNumber and Alternate Manufacturer parameters to appropriate components.

## Sheet Arak-Mux.SchDoc
size A4
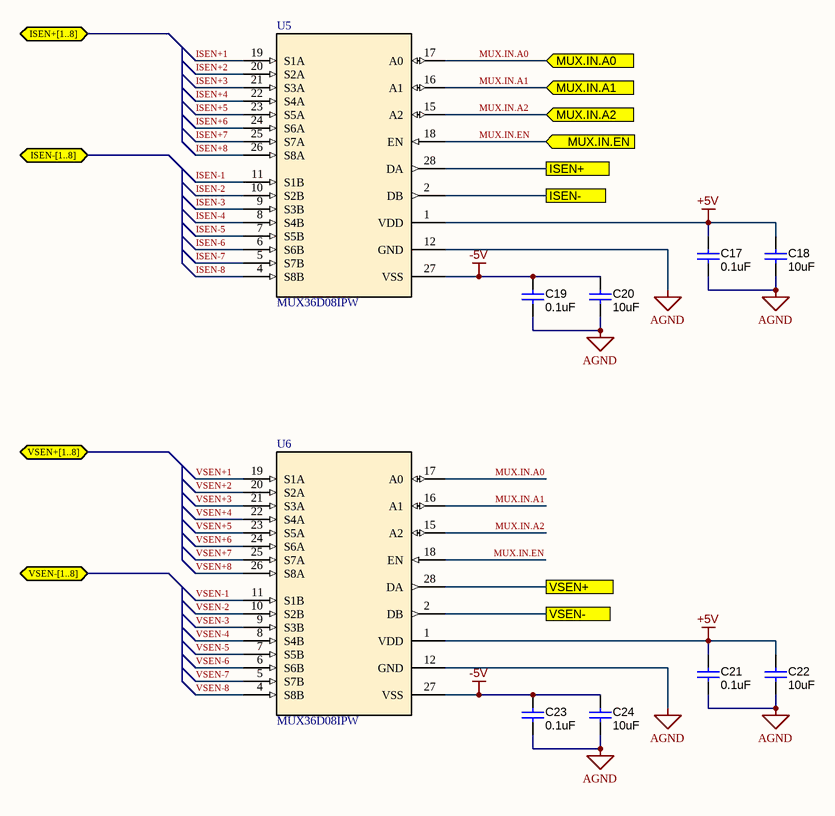
[diagram p3: Arak-Mux.SchDoc]

### Parts
C17  ValueDisplayed: 0.1uF  [0603]  (hidden comment: Capacitor)
C18  ValueDisplayed: 10uF  [0805_HV]  (hidden comment: Capacitor)
C19  ValueDisplayed: 0.1uF  [0603]  (hidden comment: Capacitor)
C20  ValueDisplayed: 10uF  [0805_HV]  (hidden comment: Capacitor)
C21  ValueDisplayed: 0.1uF  [0603]  (hidden comment: Capacitor)
C22  ValueDisplayed: 10uF  [0805_HV]  (hidden comment: Capacitor)
C23  ValueDisplayed: 0.1uF  [0603]  (hidden comment: Capacitor)
C24  ValueDisplayed: 10uF  [0805_HV]  (hidden comment: Capacitor)
U5  MUX36D08IPW  [PW0016A_N]
U6  MUX36D08IPW  [PW0016A_N]

### Ports
ISEN+, ISEN+[1..8] (bidir), ISEN-, ISEN-[1..8] (bidir), MUX.IN.A0 (in), MUX.IN.A1 (in), MUX.IN.A2 (in), MUX.IN.EN (in), VSEN+, VSEN+[1..8] (bidir), VSEN-, VSEN-[1..8] (bidir)

### Nets
+5V: C17.1 C18.1 C21.1 C22.1 U5.1(VDD) U6.1(VDD)
-5V: C19.1 C20.1 C23.1 C24.1 U5.27(VSS) U6.27(VSS)
AGND: C17.2 C18.2 C19.2 C20.2 C21.2 C22.2 C23.2 C24.2 U5.12(GND) U6.12(GND)
ISEN+1: U5.19(S1A)
ISEN+2: U5.20(S2A)
ISEN+3: U5.21(S3A)
ISEN+4: U5.22(S4A)
ISEN+5: U5.23(S5A)
ISEN+6: U5.24(S6A)
ISEN+7: U5.25(S7A)
ISEN+8: U5.26(S8A)
ISEN-1: U5.11(S1B)
ISEN-2: U5.10(S2B)
ISEN-3: U5.9(S3B)
ISEN-4: U5.8(S4B)
ISEN-5: U5.7(S5B)
ISEN-6: U5.6(S6B)
ISEN-7: U5.5(S7B)
ISEN-8: U5.4(S8B)
MUX.IN.A0: U5.17(A0) U6.17(A0) ; port MUX.IN.A0
MUX.IN.A1: U5.16(A1) U6.16(A1) ; port MUX.IN.A1
MUX.IN.A2: U5.15(A2) U6.15(A2) ; port MUX.IN.A2
MUX.IN.EN: U5.18(EN) U6.18(EN) ; port MUX.IN.EN
VSEN+1: U6.19(S1A)
VSEN+2: U6.20(S2A)
VSEN+3: U6.21(S3A)
VSEN+4: U6.22(S4A)
VSEN+5: U6.23(S5A)
VSEN+6: U6.24(S6A)
VSEN+7: U6.25(S7A)
VSEN+8: U6.26(S8A)
VSEN-1: U6.11(S1B)
VSEN-2: U6.10(S2B)
VSEN-3: U6.9(S3B)
VSEN-4: U6.8(S4B)
VSEN-5: U6.7(S5B)
VSEN-6: U6.6(S6B)
VSEN-7: U6.5(S7B)
VSEN-8: U6.4(S8B)
NetR1_2: U6.28(DA) ; port VSEN+
NetR6_2: U6.2(DB) ; port VSEN-
NetR68_2: U5.28(DA) ; port ISEN+
NetR69_2: U5.2(DB) ; port ISEN-

### Library data of the parts
C17 C19 C21 C23 = CMP-0006752-5: as C1 on sheet Arak-AnalogueFrontend; CompType: Capacitor; PackageReference: 0603; RoHS: Y; Tolerance_%: 5%; Value2: 25V; MountType: SMT; Technology: Ceramic; TempCo: X7R; Cap_Case: 0603; Published: 2008-06-19; Publisher: Texas Instruments; LatestRevisionDate: 2017-03-09; ComponentLink1Description: Datasheet link; ComponentLink1URL: http://datasheets.avx.com/X7RDielectric.pdf; Supplier 1: Digi-Key; Supplier Part Number 1: 478-3713-1-ND; Supplier 2: Mouser; Supplier Part Number 2: 581-06033C104JAT2A; Supplier 3: Farnell; Supplier Part Number 3: 1740614; AEC Qualified: N; AEC Grade: N/A
C18 C20 C22 C24 = CMP-0008315-2: as C2 on sheet Arak-AnalogueFrontend; CompType: Capacitor; PackageReference: 0805; RoHS: Y; Tolerance_%: 10%; Value2: 10V; MountType: SMT; Technology: Ceramic; TempCo: X7R; Published: 2008-06-19; Publisher: Texas Instruments; LatestRevisionDate: 2017-03-09; ComponentLink1Description: Datasheet link; ComponentLink1URL: http://search.murata.co.jp/Ceramy/PnsearchViewAction.do?HnOFG=ON&HnNFG=ON&SEL_CNT=50&sLang=en&sKey=GRM21BR71A106KE51L&x=9&y=9&search=startwith; Supplier 1: Digi-Key; Supplier Part Number 1: 490-3905-1-ND; Supplier 2: Mouser; Supplier Part Number 2: 81-GRM21BR71A106KE51; Supplier 3: Farnell; Supplier Part Number 3: 1828828; AEC Qualified: ?
U5 U6 = MUX36D08IPW: No Description Available; PartNumber: MUX36S08IPWR; Manufacturer: Texas Instruments; RefDes: RefDes; Type: DEV; Value: Value; Copyright: Copyright (C) 2018 Accelerated Designs. All rights reserved

## Sheet Arak-18650-Holder.SchDoc
size A4
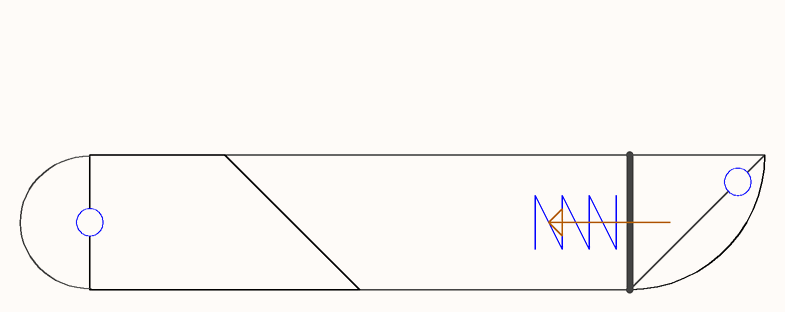
[diagram p4: Arak-18650-Holder.SchDoc]

## Sheet Arak-SlaveMux.SchDoc
size A4
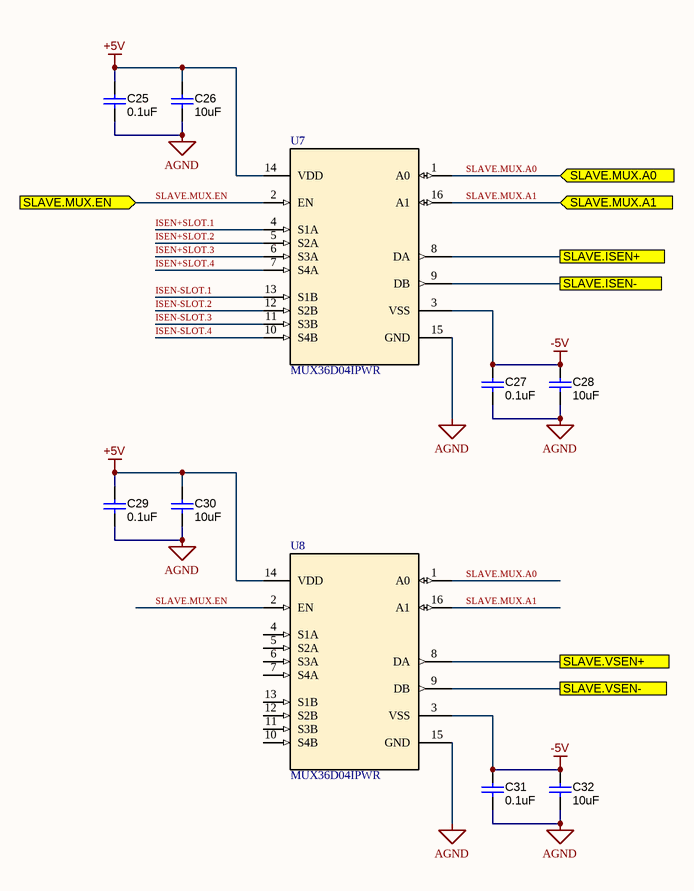
[diagram p5: Arak-SlaveMux.SchDoc]

### Parts
C25  ValueDisplayed: 0.1uF  [0603]  (hidden comment: Capacitor)
C26  ValueDisplayed: 10uF  [0805_HV]  (hidden comment: Capacitor)
C27  ValueDisplayed: 0.1uF  [0603]  (hidden comment: Capacitor)
C28  ValueDisplayed: 10uF  [0805_HV]  (hidden comment: Capacitor)
C29  ValueDisplayed: 0.1uF  [0603]  (hidden comment: Capacitor)
C30  ValueDisplayed: 10uF  [0805_HV]  (hidden comment: Capacitor)
C31  ValueDisplayed: 0.1uF  [0603]  (hidden comment: Capacitor)
C32  ValueDisplayed: 10uF  [0805_HV]  (hidden comment: Capacitor)
U7  MUX36D04IPWR  [PW0016A_N]
U8  MUX36D04IPWR  [PW0016A_N]

### Ports
SLAVE.ISEN+, SLAVE.ISEN-, SLAVE.MUX.A0 (in), SLAVE.MUX.A1 (in), SLAVE.MUX.EN (in), SLAVE.VSEN+, SLAVE.VSEN-

### Nets
+5V: C25.1 C26.1 C29.1 C30.1 U7.14(VDD) U8.14(VDD)
-5V: C27.1 C28.1 C31.1 C32.1 U7.3(VSS) U8.3(VSS)
AGND: C25.2 C26.2 C27.2 C28.2 C29.2 C30.2 C31.2 C32.2 U7.15(GND) U8.15(GND)
ISEN+SLOT.1: U7.4(S1A)
ISEN+SLOT.2: U7.5(S2A)
ISEN+SLOT.3: U7.6(S3A)
ISEN+SLOT.4: U7.7(S4A)
ISEN-SLOT.1: U7.13(S1B)
ISEN-SLOT.2: U7.12(S2B)
ISEN-SLOT.3: U7.11(S3B)
ISEN-SLOT.4: U7.10(S4B)
SLAVE.MUX.A0: U7.1(A0) U8.1(A0) ; port SLAVE.MUX.A0
SLAVE.MUX.A1: U7.16(A1) U8.16(A1) ; port SLAVE.MUX.A1
SLAVE.MUX.EN: U7.2(EN) U8.2(EN) ; port SLAVE.MUX.EN
NetU7_8: U7.8(DA) ; port SLAVE.ISEN+
NetU7_9: U7.9(DB) ; port SLAVE.ISEN-
NetU8_8: U8.8(DA) ; port SLAVE.VSEN+
NetU8_9: U8.9(DB) ; port SLAVE.VSEN-

Not connected (* = marked no-connect by the designer): U8 4(S1A) 5(S2A) 6(S3A) 7(S4A) 10(S4B) 11(S3B) 12(S2B) 13(S1B)

### Library data of the parts
C25 C27 C29 C31 = CMP-0006752-5: as C1 on sheet Arak-AnalogueFrontend; CompType: Capacitor; PackageReference: 0603; RoHS: Y; Tolerance_%: 5%; Value2: 25V; MountType: SMT; Technology: Ceramic; TempCo: X7R; Cap_Case: 0603; Published: 2008-06-19; Publisher: Texas Instruments; LatestRevisionDate: 2017-03-09; ComponentLink1Description: Datasheet link; ComponentLink1URL: http://datasheets.avx.com/X7RDielectric.pdf; Supplier 1: Digi-Key; Supplier Part Number 1: 478-3713-1-ND; Supplier 2: Mouser; Supplier Part Number 2: 581-06033C104JAT2A; Supplier 3: Farnell; Supplier Part Number 3: 1740614; AEC Qualified: N; AEC Grade: N/A
C26 C28 C30 C32 = CMP-0008315-2: as C2 on sheet Arak-AnalogueFrontend; CompType: Capacitor; PackageReference: 0805; RoHS: Y; Tolerance_%: 10%; Value2: 10V; MountType: SMT; Technology: Ceramic; TempCo: X7R; Published: 2008-06-19; Publisher: Texas Instruments; LatestRevisionDate: 2017-03-09; ComponentLink1Description: Datasheet link; ComponentLink1URL: http://search.murata.co.jp/Ceramy/PnsearchViewAction.do?HnOFG=ON&HnNFG=ON&SEL_CNT=50&sLang=en&sKey=GRM21BR71A106KE51L&x=9&y=9&search=startwith; Supplier 1: Digi-Key; Supplier Part Number 1: 490-3905-1-ND; Supplier 2: Mouser; Supplier Part Number 2: 81-GRM21BR71A106KE51; Supplier 3: Farnell; Supplier Part Number 3: 1828828; AEC Qualified: ?
U7 U8 = MUX36D04IPWR: No Description Available; Manufacturer: Texas Instruments; PartNumber: MUX36D04IPWR; RefDes: RefDes; Type: DEV; Value: Value; Copyright: Copyright (C) 2018 Accelerated Designs. All rights reserved

## Nets that join several sheets
+5V: Arak-Mux (6 pins), Arak-SlaveMux (6 pins)
-5V: Arak-AnalogueFrontend (12 pins), Arak-DAC (C130.1 U18.4), Arak-Mux (6 pins), Arak-SlaveMux (6 pins)
AGND: Arak-ADC (46 pins), Arak-AnalogueFrontend (29 pins), Arak-DAC (18 pins), Arak-Mux (10 pins), Arak-SlaveMux (10 pins)
AVDD: Arak-ADC (13 pins), Arak-DAC (C126.1 C127.1 U17.3)
DVDD_3.3V: Arak-ADC (10 pins), Arak-DAC (5 pins)
NetC1_1: Arak-AnalogueFrontend (6 pins), Arak-DAC (C129.1 L4.1 U18.8)
NetC8_2: Arak-ADC (R129.1), Arak-AnalogueFrontend (C8.2 R5.1)
NetC113_2: Arak-ADC (R114.1), Arak-AnalogueFrontend (C113.2 R73.1)
NetR1_2: Arak-AnalogueFrontend (R1.2), Arak-Mux (U6.28)
NetR6_2: Arak-AnalogueFrontend (R6.2), Arak-Mux (U6.2)
NetR68_2: Arak-AnalogueFrontend (R68.2), Arak-Mux (U5.28)
NetR69_2: Arak-AnalogueFrontend (R69.2), Arak-Mux (U5.2)